# Altium schematic sheet FPGA_power.SchDoc: FPGA power supply
size A4; Author: L. Sartory; Organization: L. Sartory; Address2: Nixie clock; Address3: with GPS synchronization; DocumentNumber: 7; Revision: B1; SheetNumber: 7; SheetTotal: 12
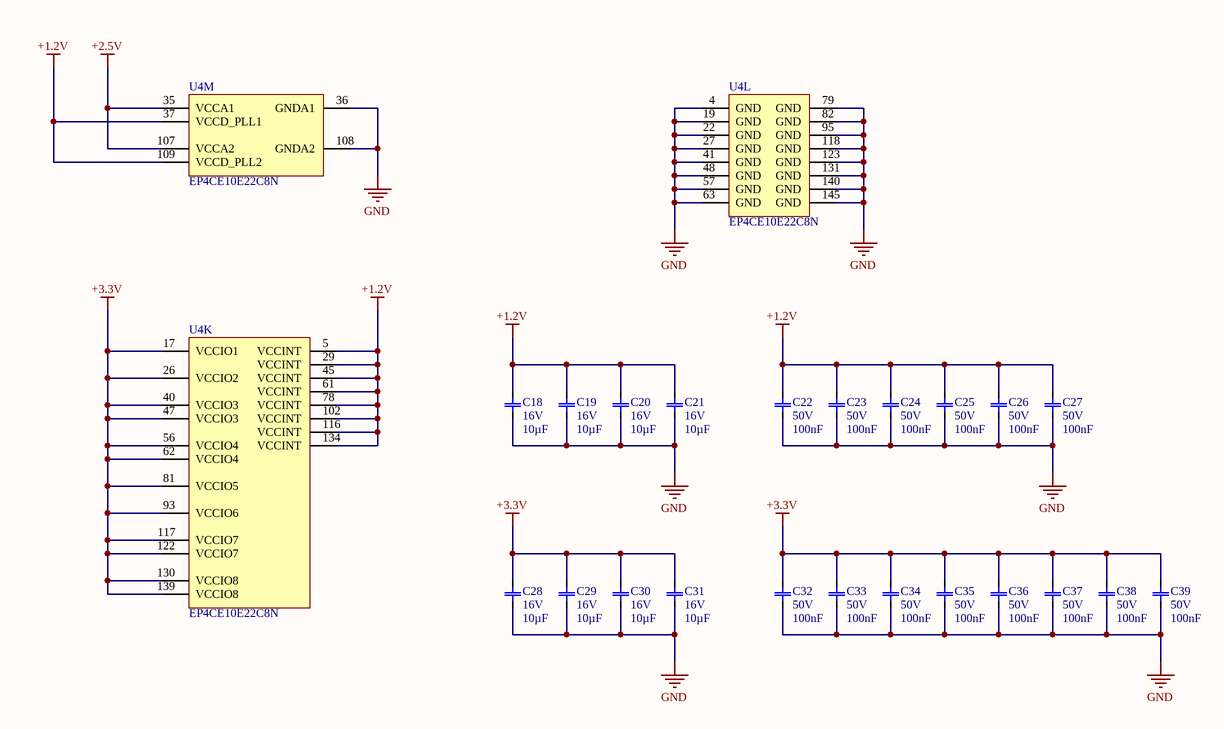
[diagram p0: FPGA_power.SchDoc]

## Parts
C18  Voltage: 16V  [MLCC_1210]  (hidden comment: 10µF)
C19  Voltage: 16V  [MLCC_1210]  (hidden comment: 10µF)
C20  Voltage: 16V  [MLCC_1210]  (hidden comment: 10µF)
C21  Voltage: 16V  [MLCC_1210]  (hidden comment: 10µF)
C22  Voltage: 50V  [MLCC_0603]  (hidden comment: 100nF)
C23  Voltage: 50V  [MLCC_0603]  (hidden comment: 100nF)
C24  Voltage: 50V  [MLCC_0603]  (hidden comment: 100nF)
C25  Voltage: 50V  [MLCC_0603]  (hidden comment: 100nF)
C26  Voltage: 50V  [MLCC_0603]  (hidden comment: 100nF)
C27  Voltage: 50V  [MLCC_0603]  (hidden comment: 100nF)
C28  Voltage: 16V  [MLCC_1210]  (hidden comment: 10µF)
C29  Voltage: 16V  [MLCC_1210]  (hidden comment: 10µF)
C30  Voltage: 16V  [MLCC_1210]  (hidden comment: 10µF)
C31  Voltage: 16V  [MLCC_1210]  (hidden comment: 10µF)
C32  Voltage: 50V  [MLCC_0603]  (hidden comment: 100nF)
C33  Voltage: 50V  [MLCC_0603]  (hidden comment: 100nF)
C34  Voltage: 50V  [MLCC_0603]  (hidden comment: 100nF)
C35  Voltage: 50V  [MLCC_0603]  (hidden comment: 100nF)
C36  Voltage: 50V  [MLCC_0603]  (hidden comment: 100nF)
C37  Voltage: 50V  [MLCC_0603]  (hidden comment: 100nF)
C38  Voltage: 50V  [MLCC_0603]  (hidden comment: 100nF)
C39  Voltage: 50V  [MLCC_0603]  (hidden comment: 100nF)
U4  EP4CE10E22C8N  [EP4CE10E22C8N]  (parts K,L,M of 13)

## Nets
+1.2V: C18.2 C19.2 C20.2 C21.2 C22.2 C23.2 C24.2 C25.2 C26.2 C27.2 U4.5(VCCINT) U4.29(VCCINT) U4.37(VCCD_PLL1) U4.45(VCCINT) U4.61(VCCINT) U4.78(VCCINT) U4.102(VCCINT) U4.109(VCCD_PLL2) U4.116(VCCINT) U4.134(VCCINT)
+2.5V: U4.35(VCCA1) U4.107(VCCA2)
+3.3V: C28.2 C29.2 C30.2 C31.2 C32.2 C33.2 C34.2 C35.2 C36.2 C37.2 C38.2 C39.2 U4.17(VCCIO1) U4.26(VCCIO2) U4.40(VCCIO3) U4.47(VCCIO3) U4.56(VCCIO4) U4.62(VCCIO4) U4.81(VCCIO5) U4.93(VCCIO6) U4.117(VCCIO7) U4.122(VCCIO7) U4.130(VCCIO8) U4.139(VCCIO8)
GND: C18.1 C19.1 C20.1 C21.1 C22.1 C23.1 C24.1 C25.1 C26.1 C27.1 C28.1 C29.1 C30.1 C31.1 C32.1 C33.1 C34.1 C35.1 C36.1 C37.1 C38.1 C39.1 U4.4(GND) U4.19(GND) U4.22(GND) U4.27(GND) U4.36(GNDA1) U4.41(GND) U4.48(GND) U4.57(GND) U4.63(GND) U4.79(GND) U4.82(GND) U4.95(GND) U4.108(GNDA2) U4.118(GND) U4.123(GND) U4.131(GND) U4.140(GND) U4.145(GND)

## Notes on the sheet
- Title
- Size:
- Date:
- A4
- Number:
- Time:
- Revision:
- Sheet
- of
- File:

## Library data of the parts
C18-C21 C28-C31 = MLCC 10µF 16V 1210: Value: 10µF
C22-C27 C32-C39 = MLCC 100nF 50V 0603: Value: 100nF
U4 = EP4CE10E22C8N: Cyclone IV Family FPGA, 1.2V Core, 91 I/O Pins, 2 PLLs, 144-Pin QFP, Speed Grade 8, Commercial Grade, Pb-Free; Manufacturer: Altera; PackageDescription: 144-Pin Plastic Enhanced Quad Flat Pack (EQFP) - Wire Bond - A:1.65 - D2:5.4; ComponentLink2Description: Handbook; DatasheetVersion: ver1.6, Nov-2011; ComponentLink2URL: http://www.altera.com/literature/hb/cyclone-iv/cyclone4-handbook.pdf; PackageVersion: ver1.0, Jan-2011; ComponentLink1URL: http://www.altera.com/; ComponentLink3Description: Pinout; ComponentLink4Description: Package Specification; PackageReference: EQFP144_A-165_D2-54; Code_JEDEC: MS-026-BFB-HD; ComponentLink3URL: http://www.altera.com/literature/lit-dp.jsp?category=cyc%204&showspreadsheet=y; ComponentLink1Description: Manufacturer URL; ComponentLink4URL: http://www.altera.com/devicepackaging/04R00402-00.pdf